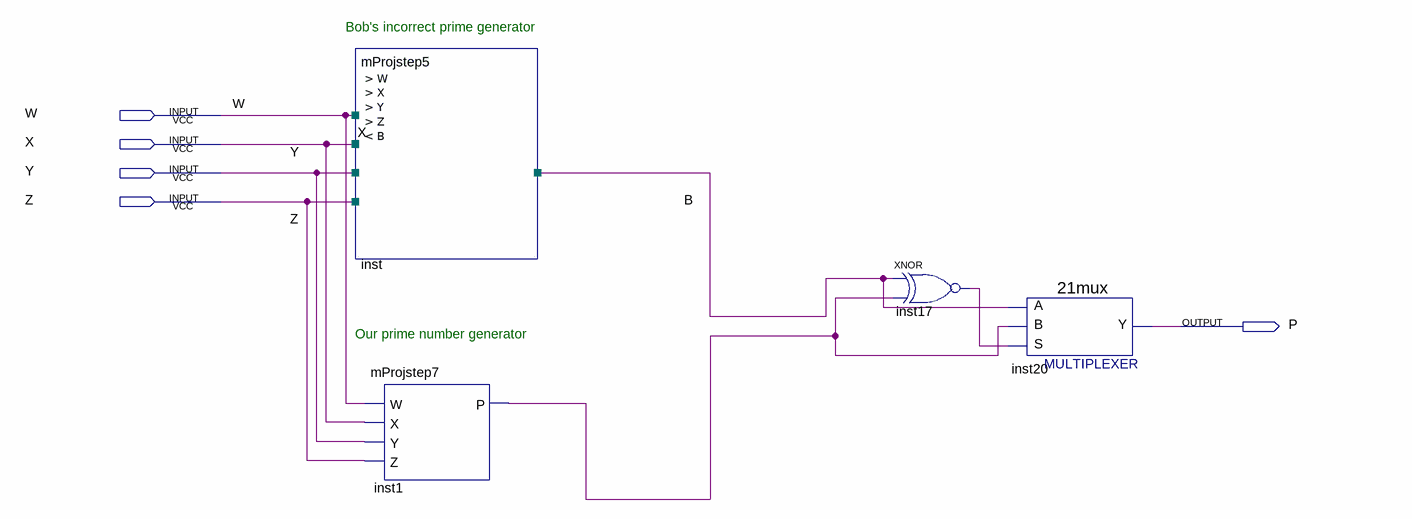
[diagram p0: schematic sheet]
// Quartus schematic mProjstep8.bdf as structural Verilog: 4 symbols, 5 pins
module mProjstep8 (
  input  W,
  input  X,
  input  Y,
  input  Z,
  output P
);

  wire B, inst1_p, inst17_out;

  mProjstep5 inst (.W(W), .X(X), .Y(Y), .Z(Z), .B(B));
  mProjstep7 inst1 (.W(W), .X(X), .Y(Y), .Z(Z), .P(inst1_p));
  xnor inst17 (inst17_out, B, inst1_p);
  \21mux  inst20 (.S(inst17_out), .B(inst1_p), .A(B), .Y(P));

  // Notes on the sheet:
  //   Bob's incorrect prime generator
  //   Our prime number generator
endmodule
